# Altium schematic sheet MCU.SchDoc
size B
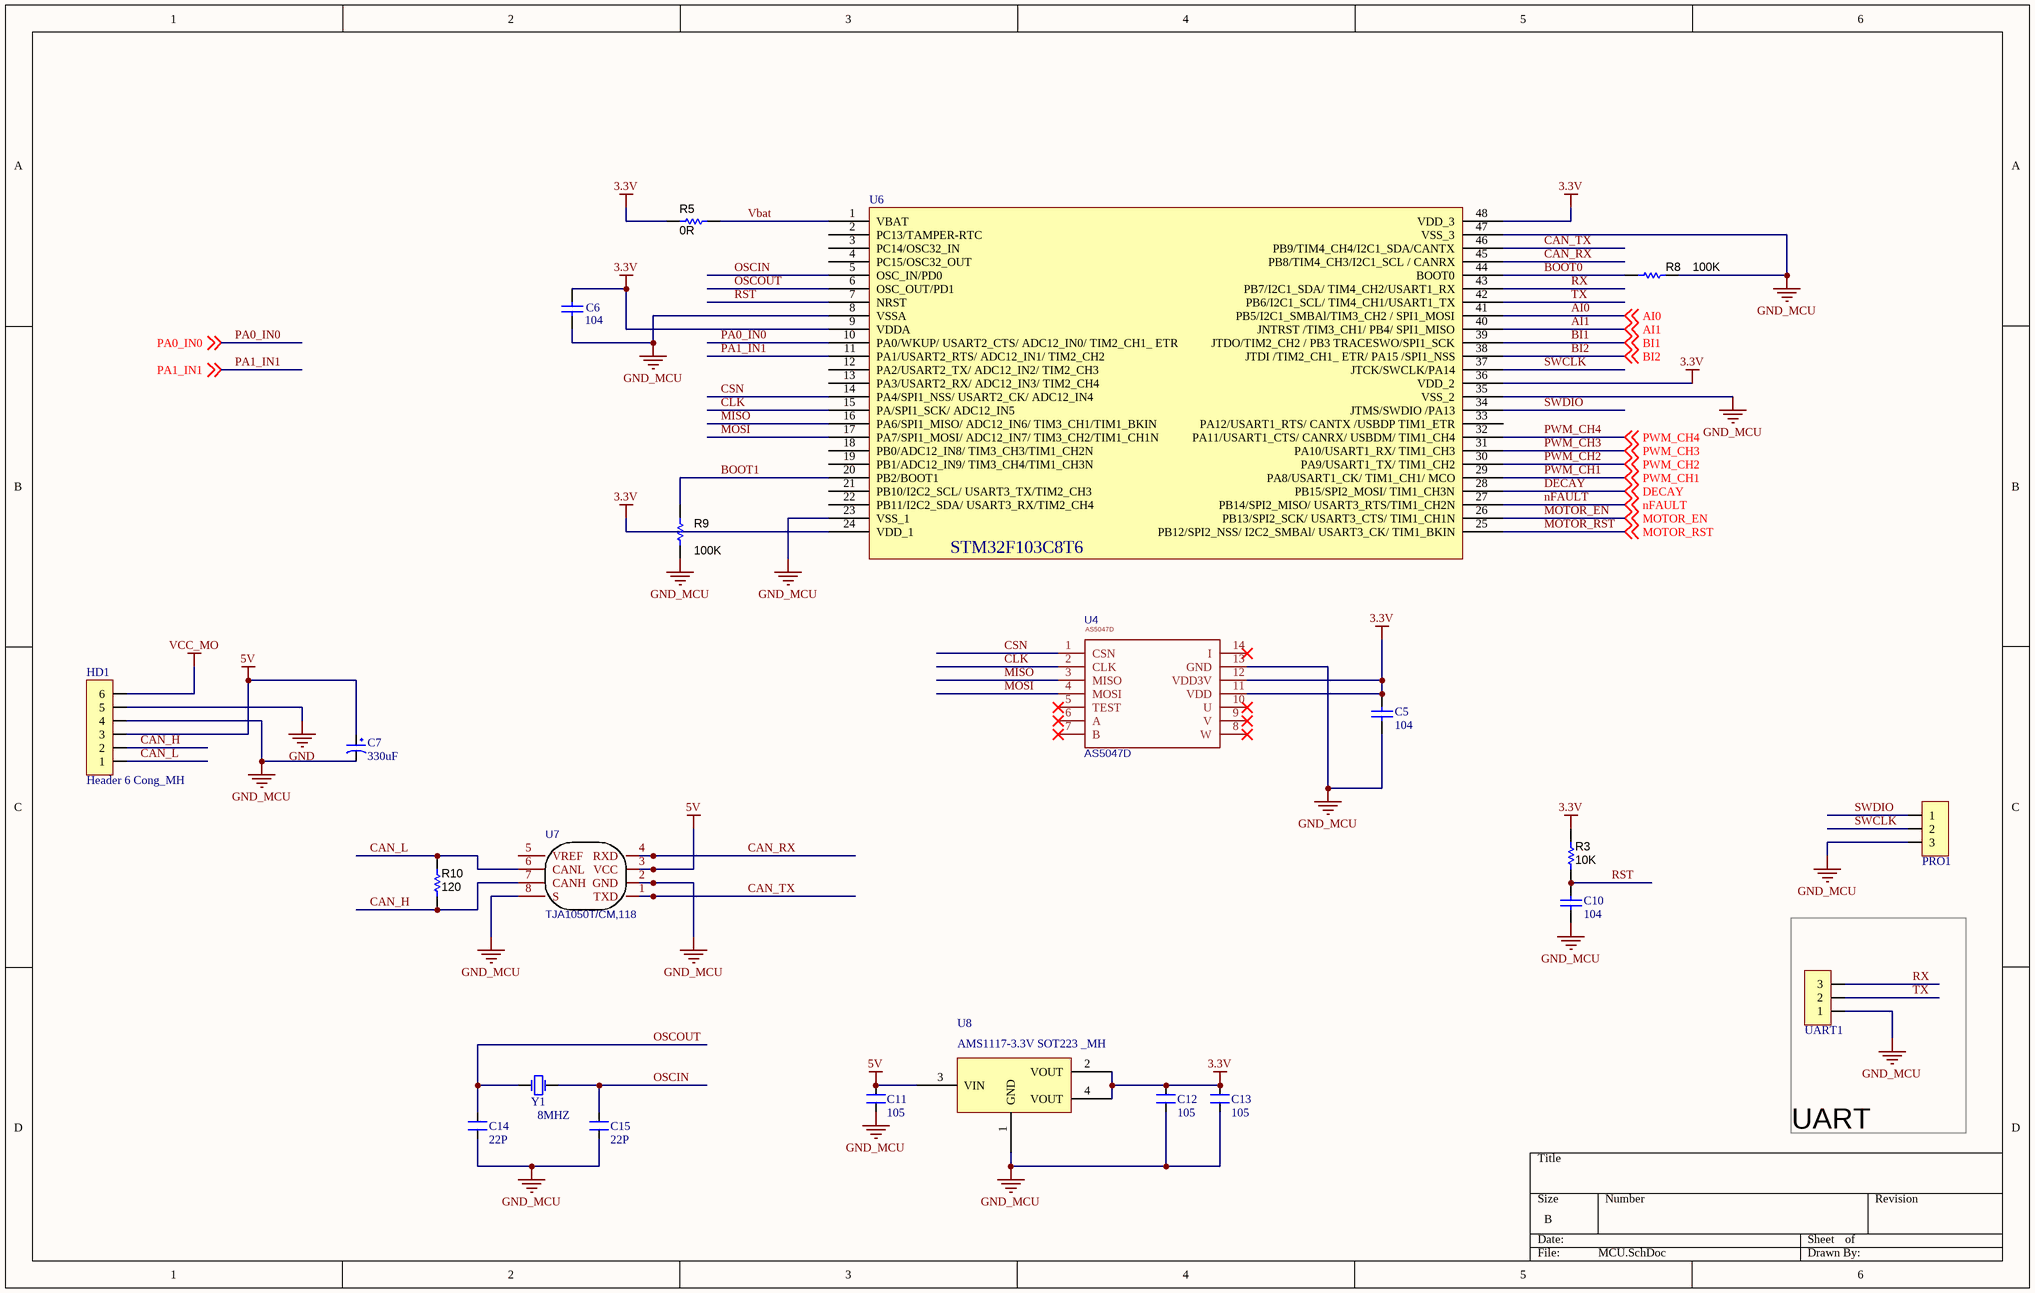
[diagram p0: MCU.SchDoc]

## Parts
C5  104  [0805_HV]
C6  104  [0805_HV]
C7  330uF  [TU_NHOM_220uF_25V_MH]
C10  104  [0805_HV]
C11  105  [0805_HV]
C12  105  [0805_HV]
C13  105  [0805_HV]
C14  22P  [0805_HV]
C15  22P  [0805_HV]
HD1  Header 6 Cong_MH  [HEADER 6 CONG]
PRO1  Header 3_MH  [HEADER 3]  (value not drawn)
R3  10K  [0805_HV]
R5  0R  [0805_HV]
R8  100K  [0805_HV]
R9  100K  [0805_HV]
R10  120  [0805_HV]
U4  AS5047D  [TSSOP14]
U6  STM32F103C8T6 LQFP48 _MH  [LQFP48]  (value not drawn)
U7  TJA1050T/CM,118  [SOP 8]
U8  AMS1117-3.3V SOT223 _MH  [SOT223]
UART1  Header 3_MH  [HEADER 3]  (value not drawn)
Y1  8MHZ  [XT2]

## Blocks framed on the sheet
UART: UART1

## Nets
3.3V: C5.2 C6.2 C12.2 C13.2 R3.2 R5.2 U4.11(VDD) U4.12(VDD3V) U6.9(VDDA) U6.24(VDD_1) U6.36(VDD_2) U6.48(VDD_3) U8.2(VOUT) U8.4(VOUT)
5V: C7.1 C11.2 HD1.3 U7.3(VCC) U8.3(VIN)
GND: HD1.5
GND_MCU: C5.1 C6.1 C7.2 C10.1 C11.1 C12.1 C13.1 C14.1 C15.1 HD1.4 PRO1.3 R8.1 R9.2 U4.13(GND) U6.8(VSSA) U6.23(VSS_1) U6.35(VSS_2) U6.47(VSS_3) U7.2(GND) U7.8(S) U8.1(GND) UART1.1
VCC_MO: HD1.6
AI0: U6.41(PB5/I2C1_SMBAl/TIM3_CH2_/_SPI1_MOSI) ; off-sheet AI0
AI1: U6.40(JNTRST_/TIM3_CH1/_PB4/_SPI1_MISO) ; off-sheet AI1
BI1: U6.39(JTDO/TIM2_CH2_/_PB3_TRACESWO/SPI1_SCK) ; off-sheet BI1
BI2: U6.38(JTDI_/TIM2_CH1__ETR/_PA15_/SPI1_NSS) ; off-sheet BI2
BOOT0: R8.2 U6.44(BOOT0)
BOOT1: R9.1 U6.20(PB2/BOOT1)
CAN_H: HD1.2 R10.2 U7.7(CANH)
CAN_L: HD1.1 R10.1 U7.6(CANL)
CAN_RX: U6.45(PB8/TIM4_CH3/I2C1_SCL_/_CANRX) U7.4(RXD)
CAN_TX: U6.46(PB9/TIM4_CH4/I2C1_SDA/CANTX) U7.1(TXD)
CLK: U4.2(CLK) U6.15(PA/SPI1_SCK/_ADC12_IN5)
CSN: U4.1(CSN) U6.14(PA4/SPI1_NSS/_USART2_CK/_ADC12_IN4)
DECAY: U6.28(PB15/SPI2_MOSI/_TIM1_CH3N) ; off-sheet DECAY
MISO: U4.3(MISO) U6.16(PA6/SPI1_MISO/_ADC12_IN6/_TIM3_CH1/TIM1_BKIN)
MOSI: U4.4(MOSI) U6.17(PA7/SPI1_MOSI/_ADC12_IN7/_TIM3_CH2/TIM1_CH1N)
MOTOR_EN: U6.26(PB13/SPI2_SCK/_USART3_CTS/_TIM1_CH1N) ; off-sheet MOTOR_EN
MOTOR_RST: U6.25(PB12/SPI2_NSS/_I2C2_SMBAl/_USART3_CK/_TIM1_BKIN) ; off-sheet MOTOR_RST
nFAULT: U6.27(PB14/SPI2_MISO/_USART3_RTS/TIM1_CH2N) ; off-sheet nFAULT
OSCIN: C15.2 U6.5(OSC_IN/PD0) Y1.2(OSC2)
OSCOUT: C14.2 U6.6(OSC_OUT/PD1) Y1.1(OSC1)
PA0_IN0: U6.10(PA0/WKUP/_USART2_CTS/_ADC12_IN0/_TIM2_CH1__ETR) ; off-sheet PA0_IN0
PA1_IN1: U6.11(PA1/USART2_RTS/_ADC12_IN1/_TIM2_CH2) ; off-sheet PA1_IN1
PWM_CH1: U6.29(PA8/USART1_CK/_TIM1_CH1/_MCO) ; off-sheet PWM_CH1
PWM_CH2: U6.30(PA9/USART1_TX/_TIM1_CH2) ; off-sheet PWM_CH2
PWM_CH3: U6.31(PA10/USART1_RX/_TIM1_CH3) ; off-sheet PWM_CH3
PWM_CH4: U6.32(PA11/USART1_CTS/_CANRX/_USBDM/_TIM1_CH4) ; off-sheet PWM_CH4
RST: C10.2 R3.1 U6.7(NRST)
RX: U6.43(PB7/I2C1_SDA/_TIM4_CH2/USART1_RX) UART1.3
SWCLK: PRO1.2 U6.37(JTCK/SWCLK/PA14)
SWDIO: PRO1.1 U6.34(JTMS/SWDIO_/PA13)
TX: U6.42(PB6/I2C1_SCL/_TIM4_CH1/USART1_TX) UART1.2
Vbat: R5.1 U6.1(VBAT)

Not connected (* = marked no-connect by the designer): U4 5(TEST)* 6(A)* 7(B)* 8(W)* 9(V)* 10(U)* 14(I)*; U6 2(PC13/TAMPER-RTC) 3(PC14/OSC32_IN) 4(PC15/OSC32_OUT) 12(PA2/USART2_TX/_ADC12_IN2/_TIM2_CH3) 13(PA3/USART2_RX/_ADC12_IN3/_TIM2_CH4) 18(PB0/ADC12_IN8/_TIM3_CH3/TIM1_CH2N) 19(PB1/ADC12_IN9/_TIM3_CH4/TIM1_CH3N) 21(PB10/I2C2_SCL/_USART3_TX/TIM2_CH3) 22(PB11/I2C2_SDA/_USART3_RX/TIM2_CH4) 33(PA12/USART1_RTS/_CANTX_/USBDP_TIM1_ETR); U7 5(VREF)

## Notes on the sheet
- (in symbol STM32F103C8T6 LQFP48 _MH) STM32F103C8T6

## Library data of the parts
C5 C6 C10 = Capacitor 0805: Ceramic Chip Capacitor - Standard; Note: Footprint corresponds to dimensions for bulk cassette packaging. This case size has tightened tolerances.; Published: 17-Jul-2002; LatestRevisionDate: 19-Mar-2004; LatestRevisionNote: Silkscreen size reduced.; DatasheetDocument: Mar-2001; PackageDocument: Mar-2001; PackageReference: 0805; Publisher: Altium Limited; Code_JEITA: 0805; Code_IPC: 2012[0805]; ComponentLink1Description: Manufacturer Link; ComponentLink1URL: http://www.kemet.com/; ComponentLink2Description: Datasheet; ComponentLink2URL: http://www.kemet.com/kemet/web/homepage/kechome.nsf/vapubfilesname/F3102TA.pdf/$file/F3102TA.pdf; Value: 104
C7 = TU_NHOM_330uF_16V_MH: Value: 47uF/16 - 50V; Description 1: 470uF/6,3V - 330uF/10V - 220uF/16V; Description 2: 100uF/25V - 35V - 47uF/50V - 22uF/100V; Description 3: 33uF => 47uF/63V - 1uF => 4,7uF/160V; Description 4: 1uF => 2,2uF/250V - 1uF/350V
C11-C15 = CM: Cap SMD; Value: 103
HD1 = Header 6 Cong_MH: Header 6P XH2.54 cong
PRO1 UART1 = Header 3_MH: Header 3P XH2.54 thẳng
R3 R5 R8-R10 = R nho: RES, 100, 1%, 0.1 W, 0402; PartNumber: ERJ-2RKF1000X; Manufacturer: Panasonic; CompType: Resistor; Res_ohm: 100; Value_Code: 100R; Tolerance_%: 1; Power_W: 0.1; Value2: 0.1W; VDC_V: 50; TempCo: 100 ppm/C; EIA_Code: E96; U/M: EA; AEC Category: Q200; SymbolVersion: 2009-05-29; PackageReference: 0402; RoHS: Y; Value1: 1%; MountType: SMT; Technology: Thick Film; Published: 2008-06-26; Publisher: Texas Instruments; LatestRevisionDate: 2016-01-08; ComponentLink1Description: Datasheet link; ComponentLink1URL: http://industrial.panasonic.com/www-data/pdf/AOA0000/AOA0000CE2.pdf; Supplier 1: Digi-Key; Supplier Part Number 1: P100LCT-ND; Supplier 2: Mouser; Supplier Part Number 2: 667-ERJ-2RKF1000X; Supplier 3: Farnell; Supplier Part Number 3: 2304034; AEC Qualified: ?
  R3: Value: 10K
  R5: Value: 0R
  R8 R9: Value: 100K
  R10: Value: 120
U7 = TJA1050T/CM,118: BOM_Manufacturer: NXP; SMT Type: Basic; BOM_Supplier: LCSC; BOM_Manufacturer Part: TJA1050T/CM,118; BOM_LCSC Assembly: Yes; image: //image.lceda.cn/szlcsc/C6952.jpg; BOM_Supplier Part: C6952; spicePre: U
Y1 = CRYSTAL_49S DIP_MH: Crystal Oscillator; Published: 8-Jun-2000; LatestRevisionDate: 17-Jul-2002; LatestRevisionNote: Re-released for DXP Platform.; PackageReference: R38; Publisher: Altium Limited
U4 = AS5047D: BOM_Manufacturer Part: ?; spicePre: U; Supplier 1: Digi-Key; Supplier Part Number 1: AS5047D-ATSMTR-ND